# EAGLE design Robot_Board_v001 (EAGLE 7.2.0)
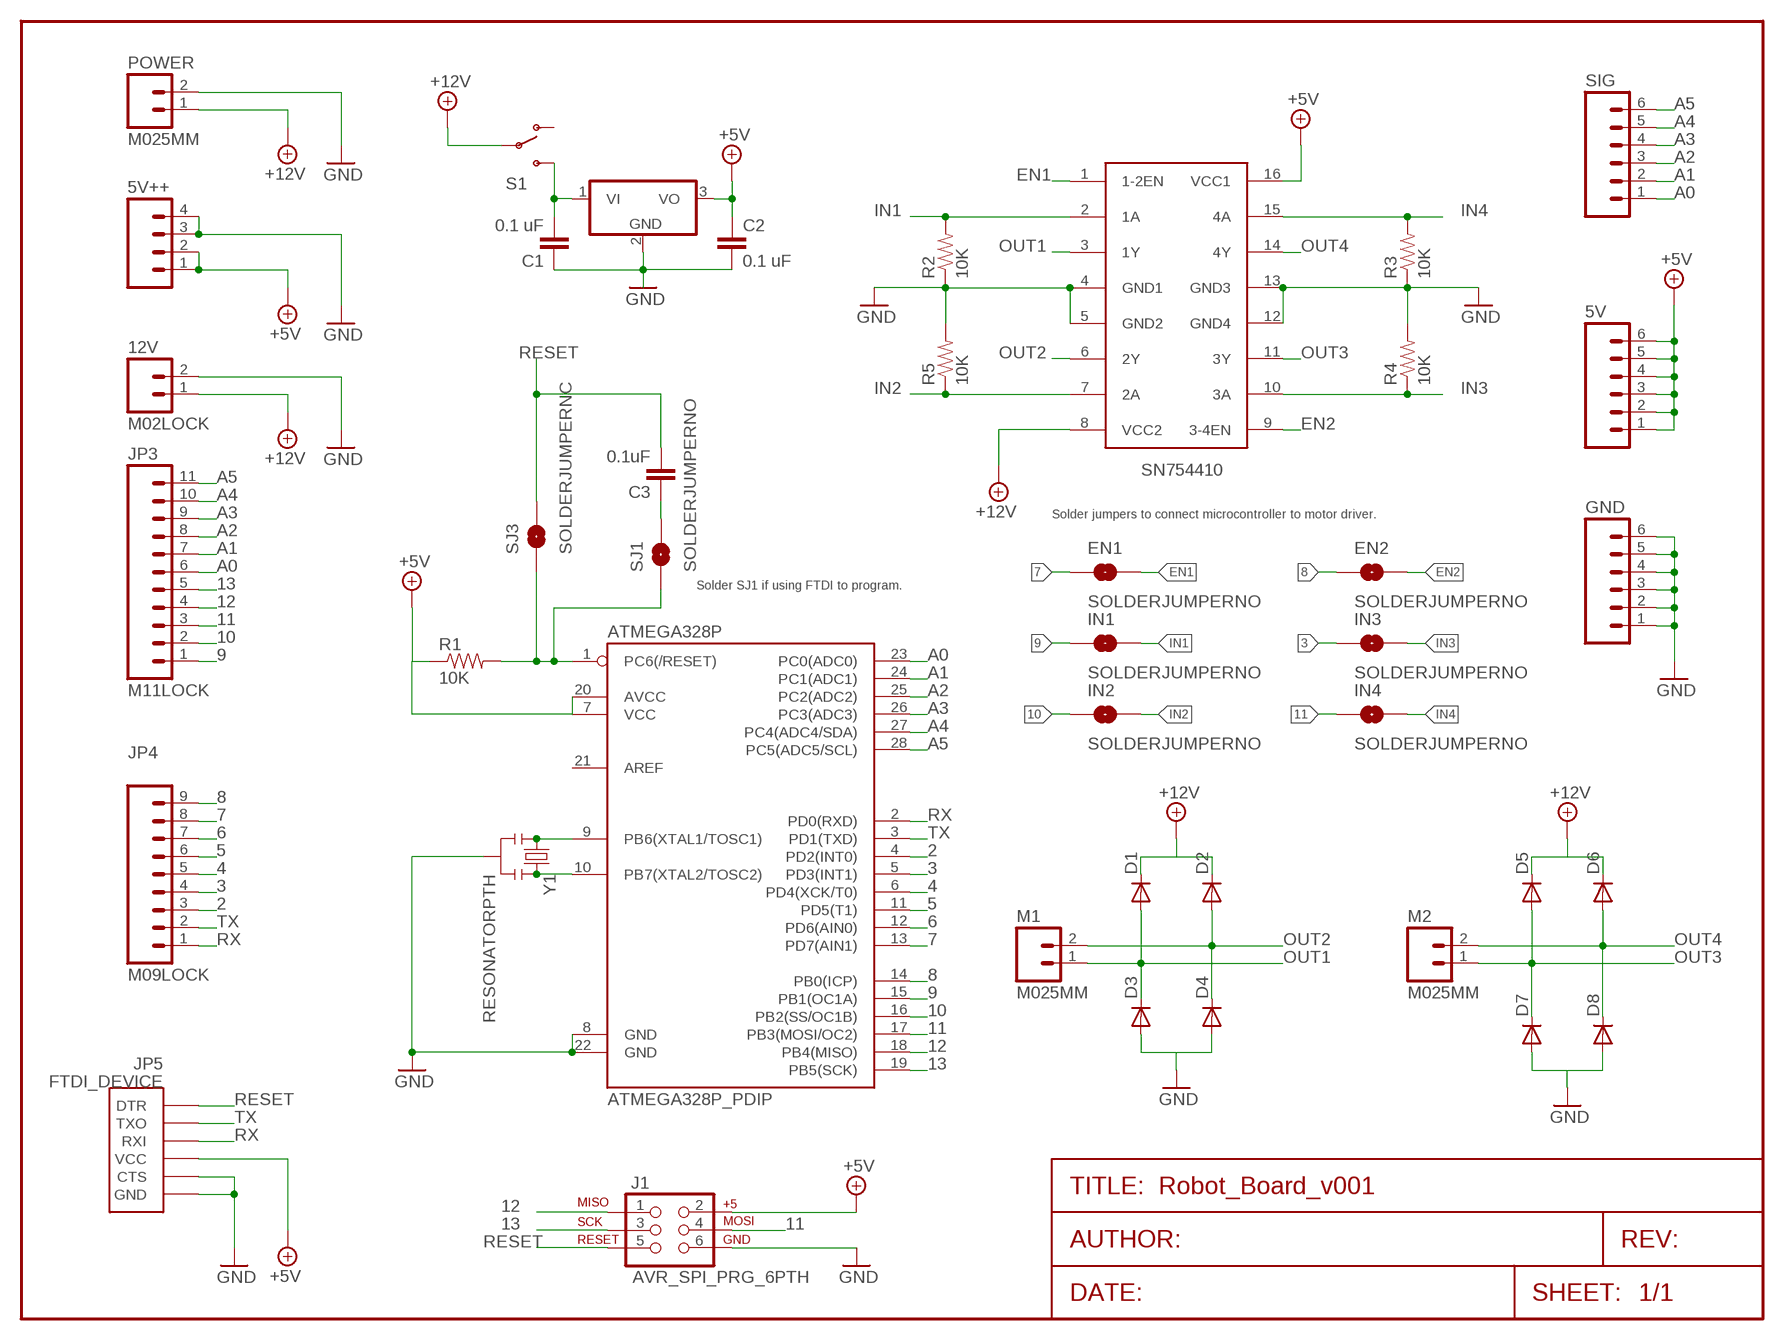
[diagram p0: schematic, sheet 1]

## Parts
5V  M06SIP  [1X06]
5V++  M04LOCK  [1X04_LOCK]
12V  M02LOCK  [1X02_LOCK]
7805  7805TV  [TO220V]
ATMEGA328P  ATMEGA328P_PDIP  [DIL28-3]
C1  0.1 uF  CAPPTH1  [CAP-PTH-5MM]
C2  0.1 uF  CAPPTH1  [CAP-PTH-5MM]
C3  0.1uF  CAPPTH1  [CAP-PTH-5MM]
D1  DIODEPTH  [DIODE-1N4001]
D2  DIODEPTH  [DIODE-1N4001]
D3  DIODEPTH  [DIODE-1N4001]
D4  DIODEPTH  [DIODE-1N4001]
D5  DIODEPTH  [DIODE-1N4001]
D6  DIODEPTH  [DIODE-1N4001]
D7  DIODEPTH  [DIODE-1N4001]
D8  DIODEPTH  [DIODE-1N4001]
EN1  SOLDERJUMPERNO  [SJ_2S-NO]
EN2  SOLDERJUMPERNO  [SJ_2S-NO]
GND  M06SIP  [1X06]
IN1  SOLDERJUMPERNO  [SJ_2S-NO]
IN2  SOLDERJUMPERNO  [SJ_2S-NO]
IN3  SOLDERJUMPERNO  [SJ_2S-NO]
IN4  SOLDERJUMPERNO  [SJ_2S-NO]
J1  AVR_SPI_PRG_6PTH  [2X3]
JP3  M11LOCK  [1X11_LOCK]
JP4  M09LOCK  [1X09_LOCK]
JP5  FTDI_DEVICE  [FTDI_DEVICE_SIDE]
M1  M025MM  [SCREWTERMINAL-5MM-2]
M2  M025MM  [SCREWTERMINAL-5MM-2]
POWER  M025MM  [SCREWTERMINAL-5MM-2]
R1  10K  RESISTORPTH-1/4W  [AXIAL-0.4]
R2  10K  RESISTORPTH-1/4W  [AXIAL-0.4]
R3  10K  RESISTORPTH-1/4W  [AXIAL-0.4]
R4  10K  RESISTORPTH-1/4W  [AXIAL-0.4]
R5  10K  RESISTORPTH-1/4W  [AXIAL-0.4]
S1  SWITCH-SPDTPTH  [SWITCH-SPDT]
SIG  M06SIP  [1X06]
SJ1  SOLDERJUMPERNO  [SJ_2S-NO]
SJ3  SOLDERJUMPERNC  [SJ_2S]
SN754410  L293D  [DIL16]
Y1  RESONATORPTH  [RESONATOR-PTH]

## Nets
2: ATMEGA328P.4(PD2(INT0)) JP4.3
3: ATMEGA328P.5(PD3(INT1)) IN3.1 JP4.4
4: ATMEGA328P.6(PD4(XCK/T0)) JP4.5
5: ATMEGA328P.11(PD5(T1)) JP4.6
6: ATMEGA328P.12(PD6(AIN0)) JP4.7
7: ATMEGA328P.13(PD7(AIN1)) EN1.1 JP4.8
8: ATMEGA328P.14(PB0(ICP)) EN2.1 JP4.9
9: ATMEGA328P.15(PB1(OC1A)) IN1.1 JP3.1
10: ATMEGA328P.16(PB2(SS/OC1B)) IN2.1 JP3.2
11: ATMEGA328P.17(PB3(MOSI/OC2)) IN4.1 J1.4 JP3.3
12: ATMEGA328P.18(PB4(MISO)) J1.1 JP3.4
13: ATMEGA328P.19(PB5(SCK)) J1.3 JP3.5
+5V [5V]: 5V++.1 5V++.2 5V.1 5V.2 5V.3 5V.4 5V.5 5V.6 7805.3(VO) ATMEGA328P.7(VCC) ATMEGA328P.20(AVCC) C2.1 J1.2 JP5.P$4(VCC) R1.P$1 SN754410.16(VCC1)
+12V [Power]: 12V.1 D1.C D2.C D5.C D6.C POWER.1 S1.2(P) SN754410.8(VCC2)
A0: ATMEGA328P.23(PC0(ADC0)) JP3.6 SIG.1
A1: ATMEGA328P.24(PC1(ADC1)) JP3.7 SIG.2
A2: ATMEGA328P.25(PC2(ADC2)) JP3.8 SIG.3
A3: ATMEGA328P.26(PC3(ADC3)) JP3.9 SIG.4
A4: ATMEGA328P.27(PC4(ADC4/SDA)) JP3.10 SIG.5
A5: ATMEGA328P.28(PC5(ADC5/SCL)) JP3.11 SIG.6
EN1: EN1.2 SN754410.1(1-2EN)
EN2: EN2.2 SN754410.9(3-4EN)
GND [Power]: 5V++.3 5V++.4 12V.2 7805.2(GND) ATMEGA328P.8(GND) ATMEGA328P.22(GND) C1.1 C2.2 D3.A D4.A D7.A D8.A GND.1 GND.2 GND.3 GND.4 GND.5 GND.6 J1.6 JP5.P$5(CTS) JP5.P$6(GND) POWER.2 R2.P$1 R3.P$1 R4.P$2 R5.P$2 SN754410.4(GND1) SN754410.5(GND2) SN754410.12(GND4) SN754410.13(GND3) Y1.2
IN1: IN1.2 R2.P$2 SN754410.2(1A)
IN2: IN2.2 R5.P$1 SN754410.7(2A)
IN3: IN3.2 R4.P$1 SN754410.10(3A)
IN4: IN4.2 R3.P$2 SN754410.15(4A)
N$1: ATMEGA328P.9(PB6(XTAL1/TOSC1)) Y1.1
N$2: ATMEGA328P.10(PB7(XTAL2/TOSC2)) Y1.3
N$3: ATMEGA328P.1(PC6(/RESET)) R1.P$2 SJ1.1 SJ3.1
N$4: C3.1 SJ1.2
N$5: 7805.1(VI) C1.2 S1.3(S)
OUT1 [Power]: D1.A D3.C M1.1 SN754410.3(1Y)
OUT2 [Power]: D2.A D4.C M1.2 SN754410.6(2Y)
OUT3 [Power]: D5.A D7.C M2.1 SN754410.11(3Y)
OUT4 [Power]: D6.A D8.C M2.2 SN754410.14(4Y)
RESET: C3.2 J1.5 JP5.P$1(DTR) SJ3.2
RX: ATMEGA328P.2(PD0(RXD)) JP4.1 JP5.P$3(RXI)
TX: ATMEGA328P.3(PD1(TXD)) JP4.2 JP5.P$2(TXO)
Unconnected: ATMEGA328P.21(AREF) S1.1(O)

## Notes on the sheet
- Solder jumpers to connect microcontroller to motor driver.
- Solder SJ1 if using FTDI to program.

## Library data of the parts
5V GND SIG = SparkFun-Connectors:M06: Header 6 Standard 6-pin 0.1" header. Use with straight break away headers (SKU : PRT-00116), right angle break away headers (PRT-00553), swiss pins (PRT-00743), machine pins (PRT-00117), and female headers (PRT-00115). Molex polarized connector foot print use with SKU : PRT-08094 with associated crimp pins and housings. NOTES ON THE VARIANTS LOCK and LOCK_LONGPADS... This footprint was designed to help hold the alignment of a through-hole component (i.e. 6-pin header) while soldering it into place. You may notice that each hole has been shifted either up or down by 0.005 of an inch from it's more standard position (which is a perfectly straight line). This slight alteration caused the pins (the squares in the middle) to touch the edges of the holes. Because they are alternating, it causes a "brace" to hold the component in place. 0.005 has proven to be the perfect amount of "off-center" position when using our standard breakaway headers. Although looks a little odd when you look at the bare footprint, once you have a header in there, the alteration is very hard to notice. Also,if you push a header all the way into place, it is covered up entirely on the bottom side. This idea of altering the position of holes to aid alignment will be further integrated into the Sparkfun Library for other footprints. It can help hold any component with 3 or more connection pins.
5V++ = SparkFun-Connectors:M04: Header 4 Standard 4-pin 0.1" header. Use with straight break away headers (SKU : PRT-00116), right angle break away headers (PRT-00553), swiss pins (PRT-00743), machine pins (PRT-00117), and female headers (PRT-00115). Molex polarized connector foot print use with SKU : PRT-08231 with associated crimp pins and housings. 1MM SMD Version SKU: PRT-10208
12V M1 M2 POWER = SparkFun-Connectors:M02: Standard 2-pin 0.1" header. Use with - straight break away headers ( PRT-00116) - right angle break away headers (PRT-00553) - swiss pins (PRT-00743) - machine pins (PRT-00117) - female headers (PRT-00115) Molex polarized connector foot print use with: PRT-08233 with associated crimp pins and housings. 2.54_SCREWTERM for use with PRT-10571. 3.5mm Screw Terminal footprints for PRT-08084 5mm Screw Terminal footprints for use with PRT-08433
7805 = linear:78*: Positive VOLTAGE REGULATOR Source: http://cache.national.com/ds/LM/LM78L05.pdf http://www.fairchildsemi.com/ds/LM/LM7805.pdf
ATMEGA328P = SparkFun-DigitalIC:ATMEGA328P_PDIP: uC used in the Arduino 32kb flash, 1k EEPROM, 2k SRAM This is the through-hole version of this chip.
C1-C3 = SparkFun-Passives:CAP: Capacitor Standard 0603 ceramic capacitor, and 0.1" leaded capacitor.
D1-D8 = SparkFun-DiscreteSemi:DIODE: Diode These are standard reverse protection diodes and small signal diodes. SMA package can handle up to about 1A. SOD-323 can handle about 200mA. What the SOD-323 package when ordering, there are some mfgs out there that are 5-pin packages.
EN1 EN2 IN1-IN4 SJ1 SJ3 = SparkFun-Passives:SOLDERJUMPER: Solder Jumper Standard SMD solder jumper. Used to automate production. Two varients : Normally Open and Normally Closed are the same, but have different paste layers. NC will have a large amount of paste and should jumper during reflow.
J1 = SparkFun-Connectors:AVR_SPI_PRG_6: AVR ISP 6 Pin This is the reduced ISP connector for AVR programming. Common on Arduino. This footprint will take up less PCB space and can be used with a 10-pin to 6-pin adapter such as SKU: BOB-08508
JP3 = SparkFun-Connectors:M11: Header 11 Standard 11-pin 0.1" header. Use with straight break away headers (SKU : PRT-00116), right angle break away headers (PRT-00553), swiss pins (PRT-00743), machine pins (PRT-00117), and female headers (PRT-00115).
JP4 = SparkFun-Connectors:M09: Header 9 Standard 9-pin 0.1" header. Use with straight break away headers (SKU : PRT-00116), right angle break away headers (PRT-00553), swiss pins (PRT-00743), machine pins (PRT-00117), and female headers (PRT-00115).
JP5 = SparkFun-Connectors:FTDI_DEVICE: Connector which mates to FTDI basic or FTDI cable.
R1-R5 = SparkFun-Passives:RESISTOR: Resistor Basic schematic elements and footprints for 0603, 1206, and PTH resistors.
S1 = SparkFun-Electromechanical:SWITCH-SPDT: SPDT Switch Simple slide switch, Spark Fun Electronics SKU : COM-00102 DPDT SMT slide switch, AYZ0202, SWCH-08179
SN754410 = st-microelectronics:L293D: PUSH-PULL 4 CHANNEL DRIVER; MPN: L293D; OC_FARNELL: 9589619; OC_NEWARK: 56P8249
Y1 = SparkFun-FreqCtrl:RESONATOR: Resonator Small SMD resonator. This is the itty bitty 10/20MHz resonators with built in caps. CSTCE10M0G55 and CSTCE20M0V53. Footprint has been reviewed closely but hasn't been tested yet.

## Net classes
0 default: width 0.305 mm, clearance 0.152 mm
1 Power: width 1.778 mm, clearance 0.203 mm
2 5V: width 0.61 mm, clearance 0.203 mm

## Board
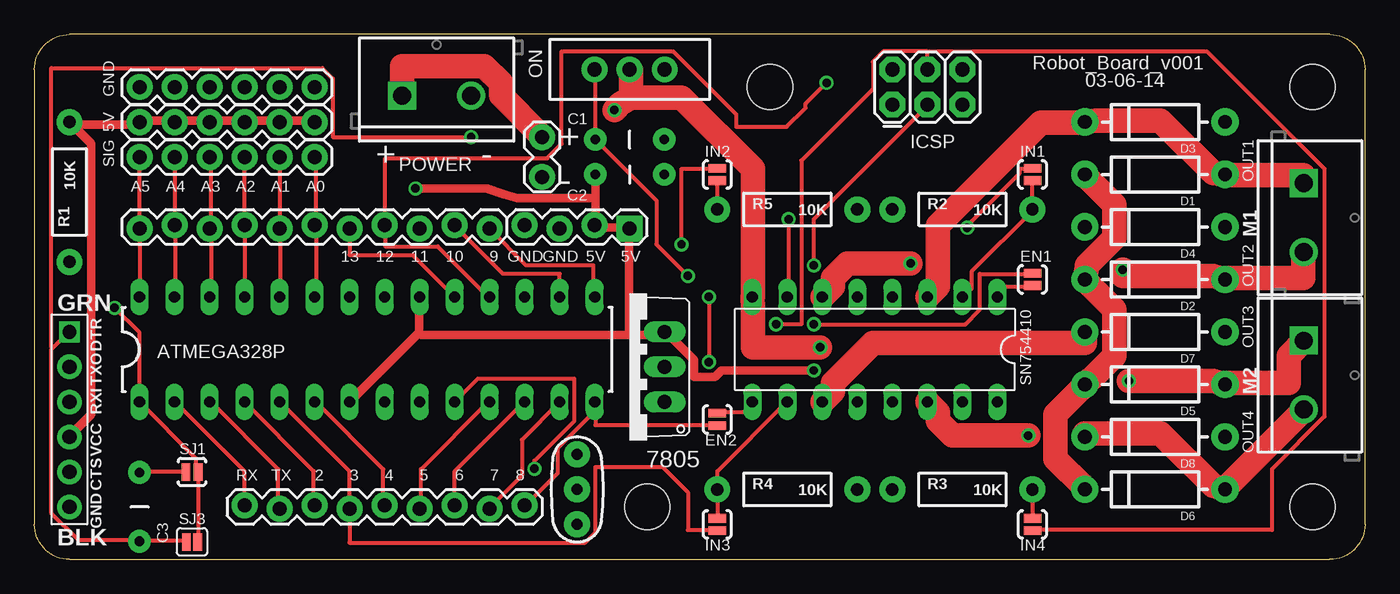
[diagram p1: board, top side]
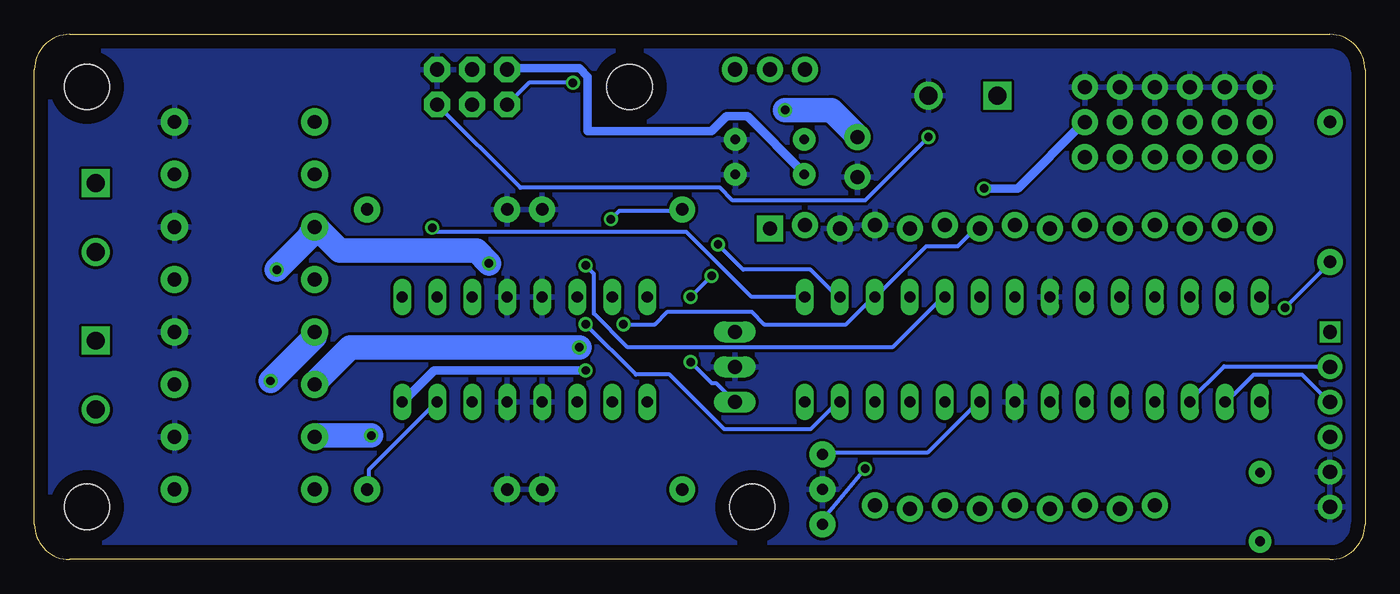
[diagram p2: board, bottom side, seen from below]

Size 96.52 x 38.1 mm. Coordinates in mm from the lower left corner, seen from the top.
Outline: 2.54,0 93.98,0 arc90 96.52,2.54 96.52,35.56 arc90 93.98,38.1 2.54,38.1 arc90 0,35.56 0,2.54 arc90 2.54,0
Copper layers (1*16): Top 0.035mm / dielectric 1.5mm / Bottom 0.035mm
Design rules: minimum track width 10mil, minimum drill 24mil, track to track 8mil, track to pad 8mil, pad to pad 8mil, via to via 8mil, smd to smd 8mil, copper to edge 40mil, drill to drill 8mil, minimum pad ring 10mil, minimum via ring 8mil, stop-mask expansion 4mil, vias tented up to drill 0mil, thermal gap 10mil

### Footprints (pad centres in the part's own frame; a part is rotated, then mirrored left to right if it is on the bottom)
1X06 = drill 1.016 pad 1.88: 1 0,0; 2 2.54,0; 3 5.08,0; 4 7.62,0; 5 10.16,0; 6 12.7,0
1X04_LOCK = drill 1.016 pad 1.88 square: 1 0,0.127 | drill 1.016 pad 1.88: 2 2.54,-0.127; 3 5.08,0.127; 4 7.62,-0.127
1X02_LOCK = drill 1.016 pad 1.88: 1 -0.178,0; 2 2.718,0
TO220V = drill 1.016 long: 1 -2.54,-2.54; 2 0,-2.54; 3 2.54,-2.54
DIL28-3 = drill 0.813 long: 1 -16.51,-3.81; 2 -13.97,-3.81; 3 -11.43,-3.81; 4 -8.89,-3.81; 5 -6.35,-3.81; 6 -3.81,-3.81; 7 -1.27,-3.81; 8 1.27,-3.81; 9 3.81,-3.81; 10 6.35,-3.81; 11 8.89,-3.81; 12 11.43,-3.81; 13 13.97,-3.81; 14 16.51,-3.81; 15 16.51,3.81; 16 13.97,3.81; 17 11.43,3.81; 18 8.89,3.81; 19 6.35,3.81; 20 3.81,3.81; 21 1.27,3.81; 22 -1.27,3.81; 23 -3.81,3.81; 24 -6.35,3.81; 25 -8.89,3.81; 26 -11.43,3.81; 27 -13.97,3.81; 28 -16.51,3.81
CAP-PTH-5MM = drill 0.7 pad 1.651: 1 -2.5,0; 2 2.5,0
DIODE-1N4001 = drill 1 pad 1.981: A -5.08,0; C 5.08,0
SJ_2S-NO = smd 0.635 x 1.27: 1 -0.45,0; 2 0.45,0
2X3 = drill 1.016 pad 1.88 octagon: 1 0,0; 2 0,2.54; 3 2.54,0; 4 2.54,2.54; 5 5.08,0; 6 5.08,2.54
1X11_LOCK = drill 1.016 pad 1.88: 1 0,0.127; 2 2.54,-0.127; 3 5.08,0.127; 4 7.62,-0.127; 5 10.16,0.127; 6 12.7,-0.127; 7 15.24,0.127; 8 17.78,-0.127; 9 20.32,0.127; 10 22.86,-0.127; 11 25.4,0.127
1X09_LOCK = drill 1.016 pad 1.88: 1 0,0.127; 2 2.54,-0.127; 3 5.08,0.127; 4 7.62,-0.127; 5 10.16,0.127; 6 12.7,-0.127; 7 15.24,0.127; 8 17.78,-0.127; 9 20.32,0.127
FTDI_DEVICE_SIDE = drill 1 square: P$1 -6.35,0 | drill 1.016 pad 1.778: P$2 -3.81,0; P$3 -1.27,0; P$4 1.27,0; P$5 3.81,0; P$6 6.35,0
SCREWTERMINAL-5MM-2 = drill 1.3 pad 2.032 square: 1 0,0 | drill 1.3 pad 2.032: 2 5,0
AXIAL-0.4 = drill 0.9 pad 1.88: P$1 -5.08,0; P$2 5.08,0
SWITCH-SPDT = drill 1.016 pad 1.88: 1 0,2.54; 2 0,0; 3 0,-2.54
SJ_2S = smd 0.635 x 1.27: 1 -0.412,0; 2 0.412,0
DIL16 = drill 0.813 long: 1 -8.89,-3.81; 2 -6.35,-3.81; 3 -3.81,-3.81; 4 -1.27,-3.81; 5 1.27,-3.81; 6 3.81,-3.81; 7 6.35,-3.81; 8 8.89,-3.81; 9 8.89,3.81; 10 6.35,3.81; 11 3.81,3.81; 12 1.27,3.81; 13 -1.27,3.81; 14 -3.81,3.81; 15 -6.35,3.81; 16 -8.89,3.81
STAND-OFF = hole 3.302: 0,0
RESONATOR-PTH = drill 0.8 pad 1.88: 1 -2.54,0; 2 0,0; 3 2.54,0

### Placement (x,y rotation side)
5V  20.32,31.75 180 top
5V++  43.18,24.13 180 top
12V  36.83,30.48 270 top
7805  43.18,13.97 90 top
ATMEGA328P  24.13,15.24 0 top
C1  43.18,30.48 180 top
C2  43.18,27.94 0 top
C3  7.62,3.81 270 top
D1  81.28,27.94 180 top
D2  81.28,20.32 180 top
D3  81.28,31.75 180 top
D4  81.28,24.13 180 top
D5  81.28,12.7 180 top
D6  81.28,5.08 180 top
D7  81.28,16.51 180 top
D8  81.28,8.89 180 top
EN1  72.39,20.32 270 top
EN2  49.53,10.16 90 top
GND  20.32,34.29 180 top
IN1  72.39,27.94 270 top
IN2  49.53,27.94 270 top
IN3  49.53,2.54 90 top
IN4  72.39,2.54 90 top
J1  62.23,33.02 0 top
JP3  33.02,24.13 180 top
JP4  15.24,3.81 0 top
JP5  2.54,10.16 270 top
M1  92.08,27.3 270 top
M2  92.08,15.88 270 top
POWER  26.67,33.66 0 top
R1  2.54,26.67 270 top
R2  67.31,25.4 0 top
R3  67.31,5.08 0 top
R4  54.61,5.08 0 top
R5  54.61,25.4 0 top
S1  43.18,35.56 270 top
SIG  20.32,29.21 180 top
SJ1  11.43,6.35 180 top
SJ3  11.43,1.27 180 top
SN754410  60.96,15.24 180 top
U$1  [STAND-OFF]  92.71,34.29 0 top
U$2  [STAND-OFF]  92.71,3.81 0 top
U$3  [STAND-OFF]  53.34,34.29 0 top
U$4  [STAND-OFF]  44.45,3.81 0 top
Y1  39.37,5.08 270 top

### Tracks (layer width: path | path; a pad name or v marks a point on that pad's centre or on a via)
2
  Top 0.305: ATMEGA328P.4 20.27,6.4 20.27,3.96 JP4.3
3
  Top 0.305: IN3.1 49.53,2.13 47.4,2.13 47.4,4.88 45.57,6.71 40.69,6.71 40.69,1.98 39.93,1.22 22.86,1.22 JP4.4 22.86,6.4 17.83,11.43 ATMEGA328P.5
4
  Top 0.305: ATMEGA328P.6 20.42,11.43 25.3,6.55 25.3,3.96 JP4.5
5
  Top 0.305: ATMEGA328P.11 32.92,11.43 28.04,6.55 28.04,3.81 JP4.6
6
  Top 0.305: JP4.7 30.48,6.4 35.51,11.43 ATMEGA328P.12
7  (via drill 0.61)
  Top 0.305: v56.54,17.07 67.51,17.07 68.58,18.14 68.58,20.73 72.39,20.73 EN1.1 | ATMEGA328P.13 35.36,8.69 35.36,6.1 33.07,3.81 JP4.8
  Bottom 0.305: v56.54,17.07 52.88,13.41 50.44,13.41 46.48,9.45 40.23,9.45 38.25,11.43 ATMEGA328P.13
8
  Top 0.305: 40.69,10.82 40.69,11.43 ATMEGA328P.14 40.69,10.82 | 40.69,10.82 40.69,9.75 49.53,9.75 EN2.1 | 40.69,10.82 37.95,8.08 37.95,6.25 35.66,3.96 JP4.9
9  (via drill 0.61)
  Top 0.305: v67.67,24.08 67.67,24.23 71.48,28.04 71.48,28.35 72.39,28.35 IN1.1 | JP3.1 33.07,23.93 35.66,21.34 40.54,21.34 40.54,19.05 ATMEGA328P.15
  Bottom 0.305: v67.67,24.08 67.36,23.77 49.23,23.77 44.5,19.05 ATMEGA328P.15
10  (via drill 0.61)
  Top 0.305: v46.94,22.86 46.94,28.35 49.53,28.35 IN2.1 | ATMEGA328P.16 38.1,20.73 33.98,20.73 30.48,24.23 JP3.2
  Bottom 0.305: v46.94,22.86 45.11,21.03 40.23,21.03 38.25,19.05 ATMEGA328P.16
11  (via drill 0.61)
  Top 0.305: 64.77,36.88 85.04,36.88 93.57,28.35 93.57,10.36 89.76,6.55 89.76,2.13 72.39,2.13 IN4.1 | J1.4 64.77,36.88 | v53.8,17.07 55.63,17.07 55.63,28.96 60.81,34.14 60.81,36.12 61.57,36.88 64.77,36.88
  Bottom 0.305: JP3.3 28.04,23.93 28.35,23.93 29.57,22.71 31.85,22.71 35.51,19.05 ATMEGA328P.17 35.66,19.05 37.64,17.07 43.59,17.07 44.5,17.98 50.6,17.98 51.51,17.07 v53.8,17.07
12  (via drill 0.61)
  Top 0.305: ATMEGA328P.18 32.92,19.05 29.26,22.71 25.45,22.71 25.45,24.23 JP3.4 25.45,24.38 25.45,29.11 37.19,29.11 38.25,30.18 38.25,36.88 46.33,36.88 50.9,32.31 50.9,31.39 54.56,31.39 55.93,32.77 55.93,33.07 v57.45,34.59
  Bottom 0.305: J1.1 60.66,34.59 v57.45,34.59
13  (via drill 0.61)
  Top 0.305: ATMEGA328P.19 27.43,22.1 22.86,22.1 JP3.5 | v56.54,21.34 56.54,24.69 64.77,32.92 J1.3
  Bottom 0.305: v56.54,21.34 55.93,20.73 55.93,17.83 53.49,15.39 34.29,15.39 30.63,19.05 ATMEGA328P.19
+5V  (via drill 0.61)
  Top 0.61: 5V.1 20.27,31.85 17.98,31.85 5V.2 17.68,31.85 15.39,31.85 5V.3 15.24,31.85 12.95,31.85 5V.4 12.65,31.85 10.36,31.85 5V.5 10.06,31.85 7.62,31.85 5V.6 7.47,31.55 3.05,31.55 R1.P$1 4.12,30.18 4.12,10.52 2.59,8.99 JP5.P$4 | 40.69,26.21 40.69,24.38 5V++.2 40.84,24.08 43.13,24.08 5V++.1 43.13,23.77 43.13,16.31 | 40.69,26.21 40.69,27.89 C2.1 | 27.89,16.46 ATMEGA328P.7 | 27.89,16.46 27.89,19.05 ATMEGA328P.20 | v56.54,13.72 49.84,13.72 49.38,13.26 47.85,13.26 47.85,14.48 45.72,16.61 7805.3 45.57,16.31 43.13,16.31 | 43.13,16.31 28.04,16.31 27.89,16.46 | v27.64,26.92 32.82,26.92 34.09,26.49 35,26.21 40.69,26.21
  Bottom 0.61: J1.2 62.18,35.66 57,35.66 56.39,35.05 56.39,31.09 47.4,31.09 46.33,32.16 44.81,32.16 40.69,28.04 C2.1 | v56.54,13.72 67.51,13.72 69.8,11.43 SN754410.16 | v27.64,26.92 25.2,26.92 20.42,31.7 5V.1
+12V  (via drill 0.61)
  Top 1.778: D6.C 76.2,5.18 74.07,7.32 74.07,10.52 76.2,12.65 D5.C 76.81,13.26 78.33,14.78 78.33,18.14 76.2,20.27 D2.C 76.35,21.18 76.35,21.34 78.33,23.32 78.33,25.76 76.2,27.89 D1.C | POWER.1 26.67,35.81 32.61,35.81 33.83,34.59 33.83,33.68 36.73,30.79 12V.1 | 43.28,33.53 46.94,33.53 52.12,28.35 52.12,19.05 SN754410.8 52.12,18.29 52.12,15.39 v57,15.39 | 43.28,33.53 43.28,35.51 S1.2 | v42.06,32.61 42.52,33.07 43.28,33.53
  Bottom 1.778: v42.06,32.61 38.71,32.61 36.88,30.79 12V.1 | v57,15.39 73.61,15.39 76.2,12.8 D5.C
A0
  Top 0.305: ATMEGA328P.23 20.42,19.05 20.42,24.23 JP3.6 20.42,24.38 20.42,29.11 SIG.1
A1
  Top 0.305: ATMEGA328P.24 17.83,19.05 17.83,23.93 JP3.7 17.83,24.08 17.83,29.11 SIG.2
A2
  Top 0.305: ATMEGA328P.25 JP3.8 SIG.3
A3
  Top 0.305: ATMEGA328P.26 12.8,19.05 12.8,23.93 JP3.9 12.8,24.08 12.8,29.11 SIG.4
A4
  Top 0.305: ATMEGA328P.27 10.21,19.05 10.21,24.23 JP3.10 10.21,24.38 10.21,29.11 SIG.5
A5
  Top 0.305: ATMEGA328P.28 JP3.11 SIG.6
EN1
  Top 0.305: EN1.2 72.39,19.81 69.95,19.81 69.95,19.05 SN754410.1
EN2
  Top 0.305: EN2.2 49.53,10.67 51.97,10.67 51.97,11.43 SN754410.9
GND
  pour Bottom: 0,38.1 0,0 96.52,0 96.52,38.1
IN1
  Top 0.305: IN1.2 R2.P$2 72.39,25.3 67.97,20.88 67.97,19.66 67.36,19.05 SN754410.2
IN2  (via drill 0.61)
  Top 0.305: R5.P$1 IN2.2 | v54.71,24.69 54.71,19.05 SN754410.7
  Bottom 0.305: v54.71,24.69 54.1,25.3 49.53,25.3 R5.P$1
IN3
  Top 0.305: IN3.2 R4.P$1 49.53,6.4 54.56,11.43 SN754410.10
IN4
  Top 0.305: R3.P$2 IN4.2
  Bottom 0.305: SN754410.15 67.36,11.43 72.24,6.55 72.24,5.18 72.39,5.18 R3.P$2
N$1
  Bottom 0.305: ATMEGA328P.9 28.04,11.43 31.7,7.77 39.17,7.77 39.32,7.62 Y1.1
N$2  (via drill 0.61)
  Top 0.305: ATMEGA328P.10 32.16,13.11 39.17,13.11 39.17,10.06 36.27,7.16 v36.27,6.58
  Bottom 0.305: v36.27,6.58 39.32,2.9 39.32,2.59 Y1.3
N$3  (via drill 0.61)
  Top 0.305: SJ3.1 11.89,1.37 11.89,6.25 SJ1.1 11.73,6.4 11.73,7.32 ATMEGA328P.1 7.62,16.46 v5.82,18.26
  Bottom 0.305: v5.82,18.26 2.59,21.49 R1.P$2
N$4
  Top 0.305: SJ1.2 10.97,6.4 7.62,6.4 C3.1
N$5  (via drill 0.61)
  Top 0.305: v48.92,19.05 v48.92,14.33 | v47.4,20.57 45.11,22.86 45.11,26.06 40.69,30.48 | 40.69,30.48 40.69,35.51 S1.3 | 40.69,30.48 C1.2
  Bottom 0.305: 7805.1 47.09,12.8 47.4,12.8 v48.92,14.33 | v47.4,20.57 v48.92,19.05
OUT1
  Top 1.778: M1.1 92.05,27.43 92.05,27.89 86.41,27.89 D1.A 85.5,28.04 81.69,31.85 76.96,31.85 D3.C 76.2,31.7 73,31.7 65.53,24.23 65.53,19.81 SN754410.3
OUT2  (via drill 0.61)
  Top 1.778: M1.2 92.05,22.25 92.05,20.42 86.41,20.42 D2.A 85.5,20.57 78.94,20.57 v78.94,21.03 | SN754410.6 57.91,19.81 57.91,20.42 58.98,21.49 v63.55,21.49
  Bottom 1.778: v63.55,21.49 64.47,22.4 74.37,22.4 76.05,24.08 76.2,24.08 D4.C 76.66,23.32 v78.94,21.03
OUT3  (via drill 0.61)
  Top 1.778: M2.1 90.98,14.78 90.98,12.8 86.41,12.8 D5.A 85.5,12.95 v79.4,12.95 | SN754410.11 57.91,12.19 57.91,12.8 60.81,15.7 76.2,15.7 D7.C
  Bottom 1.778: v79.4,12.95 76.2,16.15 D7.C
OUT4  (via drill 0.61)
  Top 1.778: M2.2 92.05,10.82 86.41,5.18 D6.A 85.5,5.33 81.69,9.14 76.2,9.14 D8.C | SN754410.14 65.53,10.67 65.53,10.06 66.6,8.99 v72.08,8.99
  Bottom 1.778: v72.08,8.99 76.2,8.99 D8.C
RESET  (via drill 0.61)
  Top 0.305: 7.62,1.37 10.97,1.37 SJ3.2 | 1.29,15.32 1.22,15.24 1.22,3.35 3.2,1.37 7.62,1.37 | 1.29,15.32 2.44,16.46 JP5.P$1 | 7.62,1.37 C3.2 | v31.67,30.66 21.64,30.66 21.64,34.9 20.88,35.66 1.22,35.66 1.22,15.39 1.29,15.32
  Bottom 0.305: J1.5 61.27,26.98 46.79,26.98 45.87,26.06 36.27,26.06 v31.67,30.66
RX
  Top 0.305: JP4.1 15.24,6.4 10.21,11.43 ATMEGA328P.2
  Bottom 0.305: JP5.P$3 2.59,11.43 4.57,13.41 8.08,13.41 10.06,11.43 ATMEGA328P.2
TX
  Top 0.305: ATMEGA328P.3 12.8,11.43 17.68,6.55 17.68,3.81 JP4.2
  Bottom 0.305: JP5.P$2 2.59,14.02 10.21,14.02 12.8,11.43 ATMEGA328P.3

### Text on the board
tPlace: Robot_Board_v001 | ON | 03-06-14 | + | ICSP | OUT1 | + | - | A5 | A4 | A3 | A2 | A1 | A0 | - | OUT2 | 13 | 12 | 11 | 10 | 9 | GND | GND | 5V | 5V | OUT3 | OUT4 | RX | TX | 2 | 3 | 4 | 5 | 6 | 7 | 8